# EAGLE design CktoPower (EAGLE 5.11)
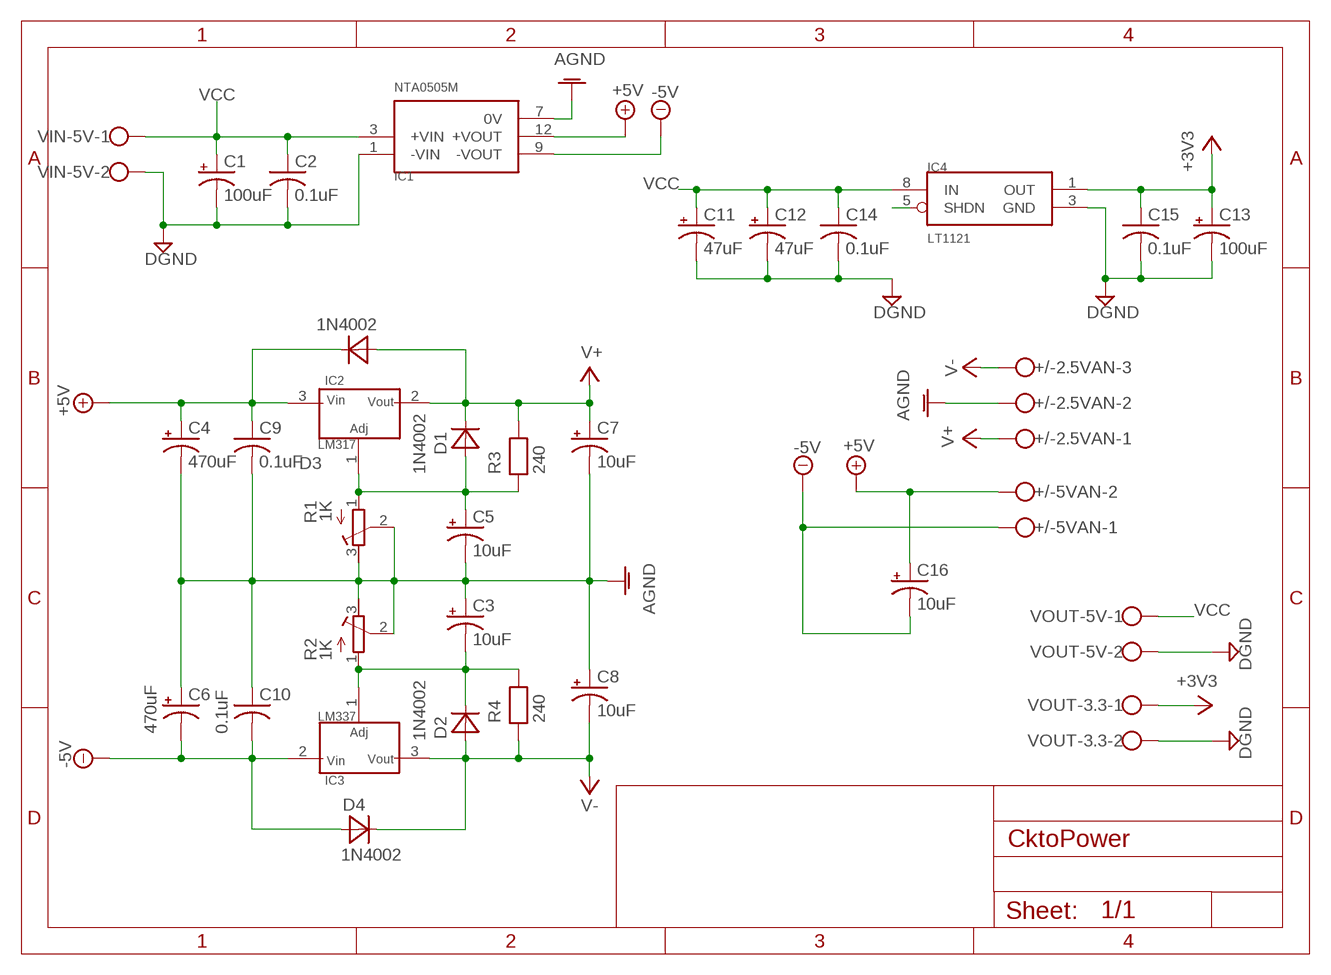
[diagram p0: schematic, sheet 1]

## Parts
+/-2.5VAN  W237-103  [W237-103]
+/-5VAN  W237-102  [W237-102]
C1  100uF  CPOL-USE  [PANASONIC_E]
C2  0.1uF  C-USC0603  [C0603]
C3  10uF  CPOL-USE2.5-5  [E2,5-5]
C4  470uF  CPOL-USE5-10.5  [E5-10,5]
C5  10uF  CPOL-USE2.5-5  [E2,5-5]
C6  470uF  CPOL-USE5-10.5  [E5-10,5]
C7  10uF  CPOL-USC/6032-28R  [C/6032-28R]
C8  10uF  CPOL-USC/6032-28R  [C/6032-28R]
C9  0.1uF  C-USC0603  [C0603]
C10  0.1uF  C-USC0603  [C0603]
C11  47uF  CPOL-USE  [PANASONIC_E]
C12  47uF  CPOL-USE  [PANASONIC_E]
C13  100uF  CPOL-USE  [PANASONIC_E]
C14  0.1uF  C-USC0603  [C0603]
C15  0.1uF  C-USC0603  [C0603]
C16  10uF  CPOL-USC/6032-28R  [C/6032-28R]
D1  1N4002  DIODE  [DIODE]
D2  1N4002  DIODE  [DIODE]
D3  1N4002  DIODE  [DIODE]
D4  1N4002  DIODE  [DIODE]
IC1  NTA0505M  [DCDC]
IC2  LM317  [TO220-S]
IC3  LM337  [TO220-S]
IC4  LT1121  LT1121-3.3  [SO08]
R1  1K  R-TRIMM64W  [RTRIM64W]
R2  1K  R-TRIMM64W  [RTRIM64W]
R3  240  R_025W  [R_025W]
R4  240  R_025W  [R_025W]
VIN-5V  W237-102  [W237-102]
VOUT-3.3  W237-102  [W237-102]
VOUT-5V  W237-102  [W237-102]

## Nets
+3V3: C13.+ C15.1 IC4.1(OUT) VOUT-3.3.1
+5V: +/-5VAN.2 C4.+ C9.1 C16.+ D3.K IC1.12(+VOUT) IC2.3(IN)
-5V: +/-5VAN.1 C6.- C10.2 C16.- D4.A IC1.9(-VOUT) IC3.2(IN)
AGND: +/-2.5VAN.2 C3.+ C4.- C5.- C6.+ C7.- C8.+ C9.2 C10.1 IC1.7(0V) R1.2(S) R1.3(A) R2.2(S) R2.3(A)
DGND: C1.- C2.2 C11.- C12.- C13.- C14.2 C15.2 IC1.1(-VIN) IC4.3(GND) VIN-5V.2 VOUT-3.3.2 VOUT-5V.2
N$1: C5.+ D1.A IC2.1(ADJ) R1.1(E) R3.1
N$2: IC4.5(SHDN)
N$3: C3.- D2.K IC3.1(ADJ) R2.1(E) R4.2
V+: +/-2.5VAN.1 C7.+ D1.K D3.A IC2.2(OUT) R3.2
V-: +/-2.5VAN.3 C8.- D2.A D4.K IC3.3(OUT) R4.1
VCC: C1.+ C2.1 C11.+ C12.+ C14.1 IC1.3(+VIN) IC4.8(IN) VIN-5V.1 VOUT-5V.1

## Library data of the parts
+/-2.5VAN = con-wago-500:W237-103: WAGO SCREW CLAMP; MPN: 237-103; OC_FARNELL: unknown; OC_NEWARK: 18M7116
+/-5VAN VIN-5V VOUT-3.3 VOUT-5V = con-wago-500:W237-102: WAGO SCREW CLAMP; MPN: 237-102; OC_FARNELL: unknown; OC_NEWARK: 70K9898
C1 C3-C8 C11-C13 C16 = rcl:CPOL-US: POLARIZED CAPACITOR, American symbol
C2 C9 C10 C14 C15 = rcl:C-US: CAPACITOR, American symbol
D1-D4 = Ricardo_Library:DIODE
IC1 = Ricardo_Library:NTA0505M
IC2 = magnetometro:LM317
IC3 = magnetometro:LM337
IC4 = Ricardo_Library:LT1121-3.3
R1 R2 = rcl:R-TRIMM: Trimm resistor
R3 R4 = Ricardo_Library:R_025W

## Board
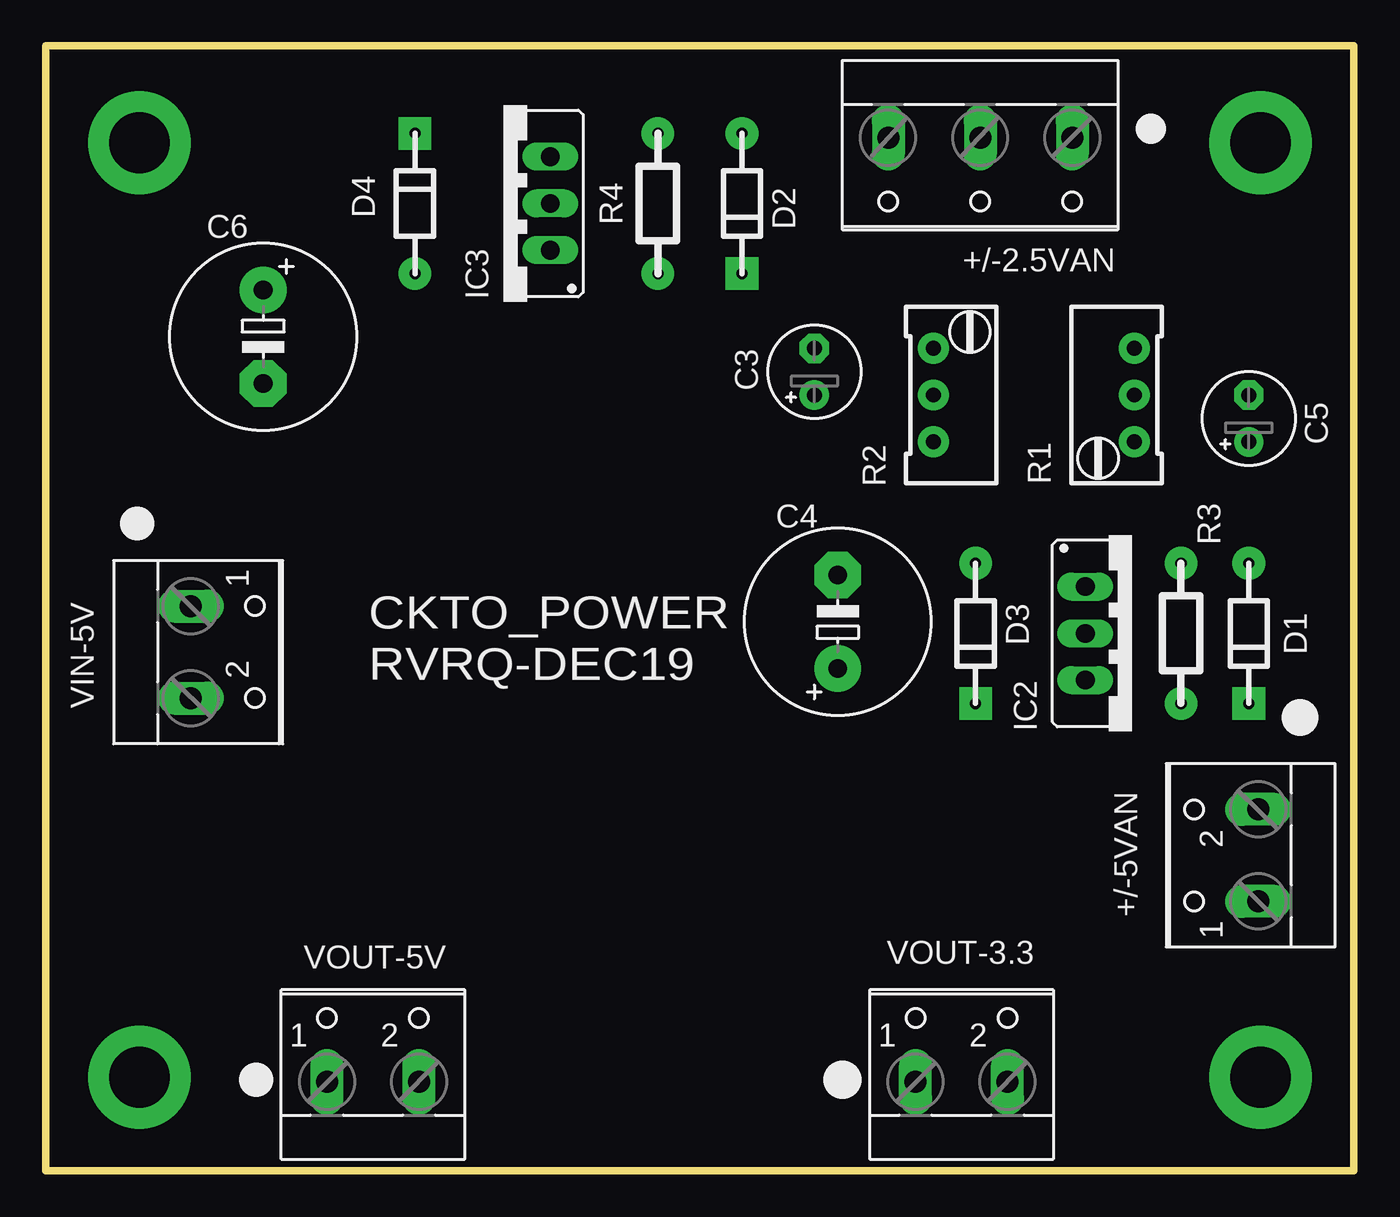
[diagram p1: board, top side]
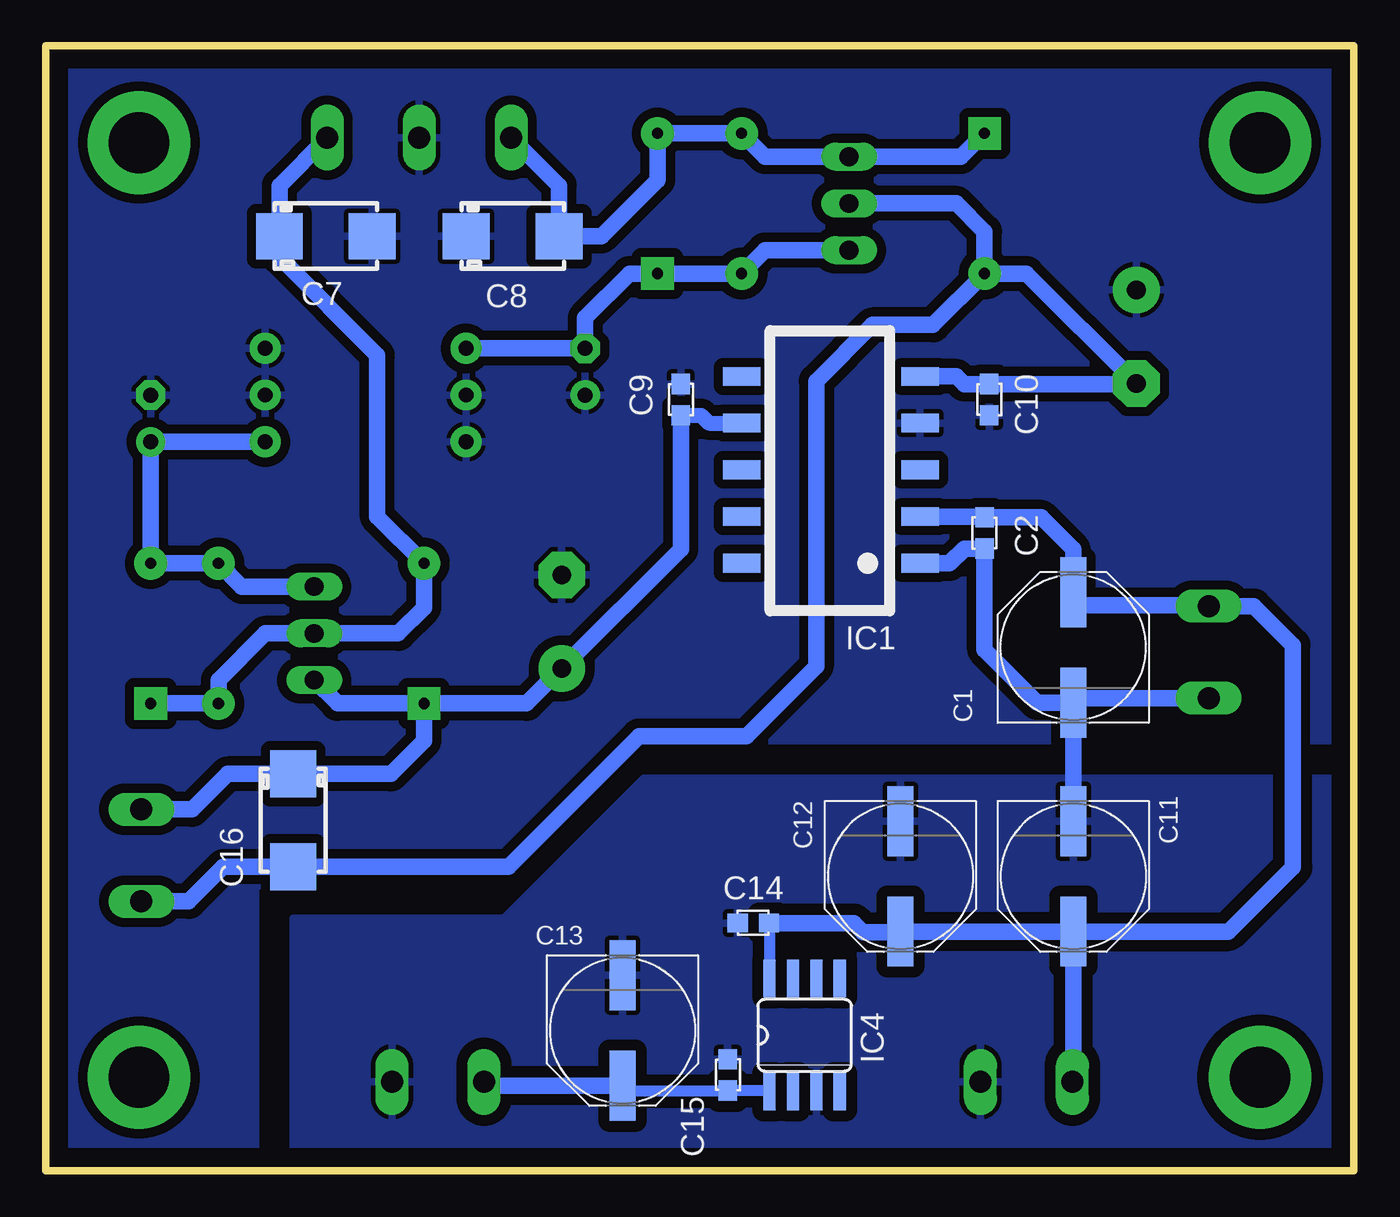
[diagram p2: board, bottom side, seen from below]

Size 71.1 x 61.14 mm. Coordinates in mm from the lower left corner, seen from the top.
Outline: 0,0 71.1,0 71.1,61.14 0,61.14 0,0
Copper layers (1*16): Top 0.035mm / dielectric 1.5mm / Bottom 0.035mm
Design rules "default": minimum track width 10mil, minimum drill 24mil, track to track 8mil, track to pad 8mil, pad to pad 8mil, via to via 8mil, smd to smd 8mil, copper to edge 40mil, drill to drill 8mil, minimum pad ring 10mil, minimum via ring 8mil, stop-mask expansion 4mil, vias tented up to drill 0mil, thermal gap 10mil

### Footprints (pad centres in the part's own frame; a part is rotated, then mirrored left to right if it is on the bottom)
W237-103 = drill 1.194 long: 1 -5,-1.29; 2 0,-1.29; 3 5,-1.29
W237-102 = drill 1.194 long: 1 -2.5,-1.27; 2 2.5,-1.27
PANASONIC_E = smd 3.8 x 1.4: + 3,0; - -3,0
C0603 = smd 1.1 x 1: 1 -0.85,0; 2 0.85,0
E2,5-5 = drill 0.813 pad 1.6 round: + -1.27,0 | drill 0.813 pad 1.6 octagon: - 1.27,0
E5-10,5 = drill 1.016 pad 2.54 round: + -2.54,0 | drill 1.016 pad 2.54 octagon: - 2.54,0
C/6032-28R = smd 2.55 x 2.5: + 2.525,0; - -2.525,0
DIODE = drill 0.61 pad 1.778 round: A -3.81,0 | drill 0.61 pad 1.778 square: K 3.81,0
DCDC = smd 1.016 x 2.032: 1 -5.08,-4.623; 3 -2.54,-4.623; 5 0,-4.623; 7 2.54,-4.623; 9 5.08,-4.623; 10 5.08,5.08; 12 2.54,5.08; 14 0,5.08; 16 -2.54,5.08; 18 -5.08,5.08
TO220-S = drill 1.016 long: 1 -2.54,0; 2 0,0; 3 2.54,0
SO08 = smd 0.66 x 2.032: 1 -1.905,-3.073; 2 -0.635,-3.073; 3 0.635,-3.073; 4 1.905,-3.073; 5 1.905,3.073; 6 0.635,3.073; 7 -0.635,3.073; 8 -1.905,3.073
RTRIM64W = drill 0.8 pad 1.676 round: 1 1.27,-2.54; 2 1.27,0; 3 1.27,2.54
R_025W = drill 0.61 pad 1.778 round: 1 -3.81,0; 2 3.81,0

### Placement (x,y rotation side)
+/-2.5VAN  50.8,54.86 180 top
+/-5VAN  64.64,17.14 90 top
C1  15.24,28.45 90 bottom
C2  20.07,34.67 270 bottom
C3  41.78,43.43 90 top
C4  43.05,29.84 90 top
C5  65.41,40.89 90 top
C6  11.81,45.34 270 top
C7  55.88,50.8 180 bottom
C8  45.72,50.8 180 bottom
C9  36.58,41.91 90 bottom
C10  19.81,41.91 90 bottom
C11  15.24,16 270 bottom
C12  24.64,16 270 bottom
C13  39.75,7.62 270 bottom
C14  32.64,13.46 180 bottom
C15  34.04,5.21 90 bottom
C16  57.66,19.05 90 bottom
D1  65.41,29.21 270 top
D2  37.85,52.58 270 top
D3  50.55,29.21 270 top
D4  20.07,52.58 90 top
IC1  28.19,38.1 90 bottom
IC2  56.52,29.21 270 top
IC3  27.43,52.58 90 top
IC4  29.84,7.37 0 bottom
R1  57.91,42.16 0 top
R2  49.53,42.16 180 top
R3  61.72,29.21 270 top
R4  33.27,52.58 270 top
VIN-5V  9.14,28.19 270 top
VOUT-3.3  49.78,6.1 0 top
VOUT-5V  17.78,6.1 0 top

### Tracks (layer width: path | path; a pad name or v marks a point on that pad's centre or on a via)
+3V3
  Bottom 0.61: IC4.1 31.75,4.36 C15.1 34.04,4.32 39.12,4.32 arc51 C13.+
  Bottom 0.889: C13.+ 47.08,4.62 VOUT-3.3.1
+5V
  Bottom 0.813: IC1.12 35.05,40.64 35.47,41.06 C9.1
  Bottom 0.889: IC2.3 55.24,25.4 D3.K | C9.1 36.58,33.78 C4.+ 44.96,25.4 D3.K | +/-5VAN.2 63.16,19.64 61.23,21.57 C16.+ 52.34,21.57 50.55,23.37 D3.K
-5V
  Bottom 0.889: IC1.9 21.59,43.18 21.17,42.76 C10.2 | C10.2 19.75,42.82 | IC3.2 21.59,52.58 20.07,51.05 D4.A | +/-5VAN.1 63.33,14.64 61.45,16.52 C16.- 45.96,16.52 38.86,23.62 33.02,23.62 29.21,27.43 29.21,42.93 26.16,45.97 22.86,45.97 D4.A | C10.2 11.85,42.76 C6.- 17.78,48.77 D4.A
AGND
  pour Bottom (isolate 0.508): 0,61.21 71.12,61.21 71.12,0.25 59.69,0.25 59.69,15.49 46.48,15.49 38.61,23.37 0,23.37
DGND
  Bottom 0.889: VIN-5V.2 14.99,25.69 C1.- | C1.- 17.19,25.45 20.07,28.32 C2.2 21.17,33.82 21.97,33.02 IC1.1 | C11.- C1.-
  pour Bottom (isolate 0.61): 0,21.34 38.61,21.34 46.23,13.72 57.66,13.72 57.66,0 0,0
N$1
  Bottom 0.889: R1.1 C5.+ D1.A R3.1 60.45,31.75 IC2.1
N$3
  Bottom 0.889: IC3.1 32,50.04 R4.2 D2.K 39.37,48.77 41.78,46.35 C3.- R2.1
N$4  (via drill 3.3 pad 5.59)
  other vias: 5.08,5.08
N$7  (via drill 3.3 pad 5.59)
  other vias: 5.08,55.88
N$8  (via drill 3.3 pad 5.59)
  other vias: 66.04,5.08
N$9  (via drill 3.3 pad 5.59)
  other vias: 66.04,55.88
V+
  Bottom 0.889: +/-2.5VAN.1 58.41,53.55 C7.+ 58.41,49.64 53.09,44.32 53.09,35.56 D3.A 50.55,30.61 51.94,29.21 IC2.2 59.18,29.21 61.72,26.67 R3.2 D1.K
V-
  Bottom 0.889: D4.K 21.34,55.12 IC3.3 32,55.12 R4.1 D2.A 37.85,53.85 40.89,50.8 C8.- 43.2,53.55 +/-2.5VAN.3
VCC
  Bottom 0.61: IC4.8 31.75,13.46 C14.1
  Bottom 0.889: IC1.3 20.11,35.56 C2.1 16.98,35.52 15.24,33.78 C1.+ 15.24,30.73 7.91,30.73 VIN-5V.1 5.42,30.69 3.3,28.57 3.3,16.51 6.81,13 C11.+ | VOUT-5V.1 15.24,4.87 C11.+ | C11.+ C12.+ 24.69,12.95 26.67,12.95 27.18,13.46 C14.1

### Text on the board
tPlace: CKTO_POWER | RVRQ-DEC19